# EAGLE schematic sang (EAGLE 6.0)
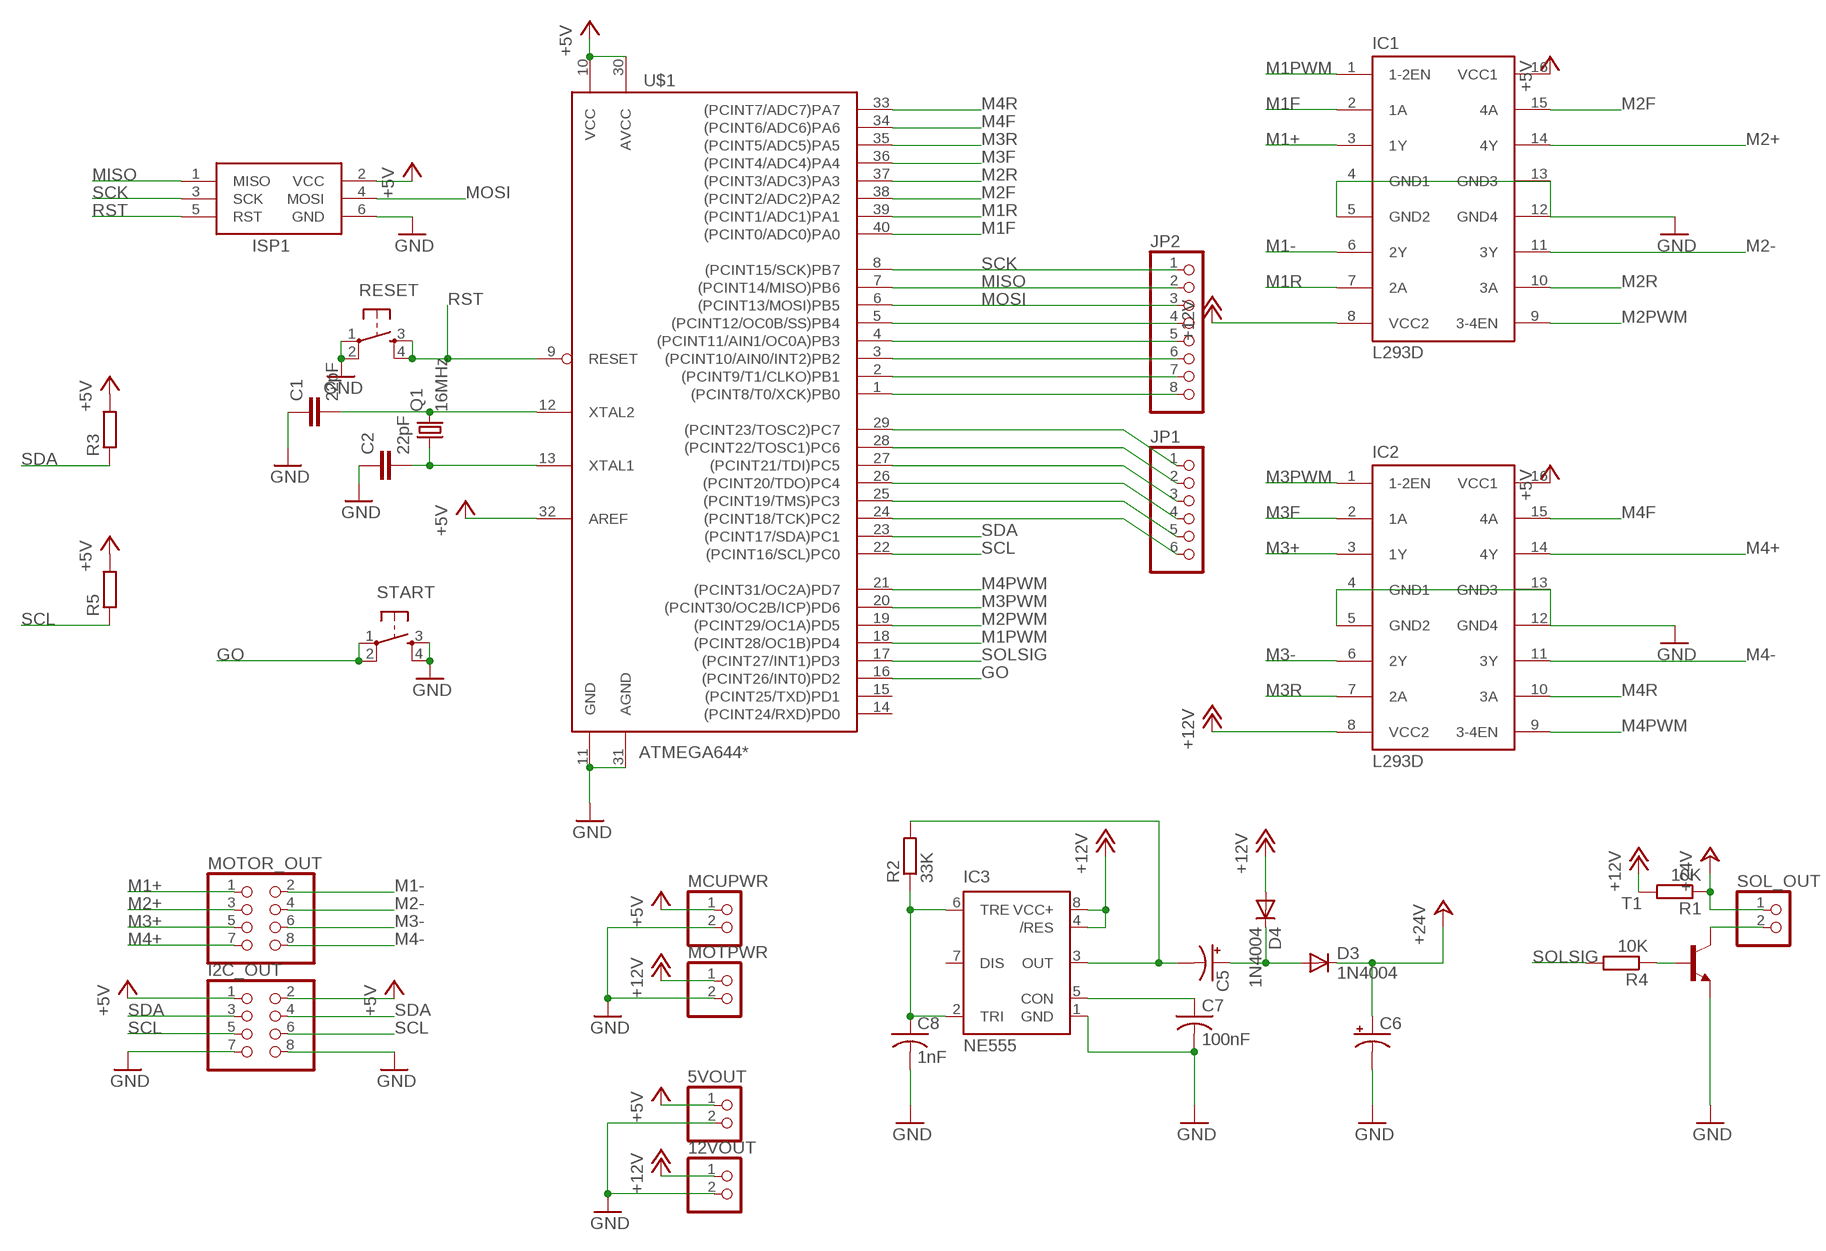
[diagram p0: schematic, sheet 1]

## Parts
5VOUT  PINHD-1X2  [1X02]
12VOUT  PINHD-1X2  [1X02]
C1  22pF  C2.5/2  [C2.5-2]
C2  22pF  C2.5/2  [C2.5-2]
C5  CPOL-USE7.5-18  [E7,5-18]
C6  CPOL-USE7.5-18  [E7,5-18]
C7  100nF  C-US025-030X050  [C025-030X050]
C8  1nF  C-US025-030X050  [C025-030X050]
D3  1N4004  [DO41-10]
D4  1N4004  [DO41-10]
I2C_OUT  PINHD-2X4  [2X04]
IC1  L293D  [DIL16]
IC2  L293D  [DIL16]
IC3  NE555  [DIL-08]
ISP1  AVRISP-6  [AVRISP]
JP1  PINHD-1X6  [1X06]
JP2  PINHD-1X8BIG  [1X08-BIG]
MCUPWR  PINHD-1X2  [1X02]
MOTOR_OUT  PINHD-2X4  [2X04]
MOTPWR  PINHD-1X2  [1X02]
Q1  16MHz  CRYSTALHC49U70  [HC49U70]
R1  10K  R-EU_0207/10  [0207/10]
R2  33K  R-EU_0207/10  [0207/10]
R3  R-EU_0204/7  [0204/7]
R4  10K  R-EU_0207/10  [0207/10]
R5  R-EU_0204/7  [0204/7]
RESET  TAC_SWITCHPTH  [TACTILE-PTH]
SOL_OUT  PINHD-1X2  [1X02]
START  TAC_SWITCHPTH  [TACTILE-PTH]
T1  2N2218-NPN-TO39-EBC  [TO39]
U$1  ATMEGA644*  [ATMEGA644]

## Nets
+5V [LowPow]: 5VOUT.1 I2C_OUT.1 I2C_OUT.2 IC1.16(VCC1) IC2.16(VCC1) ISP1.2(VCC) MCUPWR.1 R3.2 R5.2 U$1.10(VCC) U$1.30(AVCC) U$1.32(AREF)
+12V [HighPow]: 12VOUT.1 D4.A IC1.8(VCC2) IC2.8(VCC2) IC3.4(/RES) IC3.8(VCC+) MOTPWR.1 R1.2
+24V [HighPow]: C6.+ D3.C R1.1 SOL_OUT.1
GND [HighPow]: 5VOUT.2 12VOUT.2 C1.1 C2.1 C6.- C7.2 C8.2 I2C_OUT.7 I2C_OUT.8 IC1.4(GND1) IC1.5(GND2) IC1.12(GND4) IC1.13(GND3) IC2.4(GND1) IC2.5(GND2) IC2.12(GND4) IC2.13(GND3) IC3.1(GND) ISP1.6(GND) MCUPWR.2 MOTPWR.2 RESET.1 RESET.2 START.3 START.4 T1.1(E) U$1.11(GND) U$1.31(AGND)
GO: START.1 START.2 U$1.16((PCINT26/INT0)PD2)
M1+ [HighPow]: IC1.3(1Y) MOTOR_OUT.1
M1- [HighPow]: IC1.6(2Y) MOTOR_OUT.2
M1F: IC1.2(1A) U$1.40((PCINT0/ADC0)PA0)
M1PWM: IC1.1(1-2EN) U$1.18((PCINT28/OC1B)PD4)
M1R: IC1.7(2A) U$1.39((PCINT1/ADC1)PA1)
M2+: IC1.14(4Y) MOTOR_OUT.3
M2- [HighPow]: IC1.11(3Y) MOTOR_OUT.4
M2F: IC1.15(4A) U$1.38((PCINT2/ADC2)PA2)
M2PWM: IC1.9(3-4EN) U$1.19((PCINT29/OC1A)PD5)
M2R: IC1.10(3A) U$1.37((PCINT3/ADC3)PA3)
M3+ [HighPow]: IC2.3(1Y) MOTOR_OUT.5
M3- [HighPow]: IC2.6(2Y) MOTOR_OUT.6
M3F: IC2.2(1A) U$1.36((PCINT4/ADC4)PA4)
M3PWM: IC2.1(1-2EN) U$1.20((PCINT30/OC2B/ICP)PD6)
M3R: IC2.7(2A) U$1.35((PCINT5/ADC5)PA5)
M4+ [HighPow]: IC2.14(4Y) MOTOR_OUT.7
M4- [HighPow]: IC2.11(3Y) MOTOR_OUT.8
M4F: IC2.15(4A) U$1.34((PCINT6/ADC6)PA6)
M4PWM: IC2.9(3-4EN) U$1.21((PCINT31/OC2A)PD7)
M4R: IC2.10(3A) U$1.33((PCINT7/ADC7)PA7)
MISO [LowPow]: ISP1.1(MISO) JP2.2 U$1.7((PCINT14/MISO)PB6)
MOSI [LowPow]: ISP1.4(MOSI) JP2.3 U$1.6((PCINT13/MOSI)PB5)
N$1: C1.2 Q1.2 U$1.12(XTAL2)
N$2: C2.2 Q1.1 U$1.13(XTAL1)
N$3: C8.1 IC3.2(TRI) IC3.6(TRE) R2.1
N$4: R4.1 T1.2(B)
N$5: C5.- IC3.3(OUT) R2.2
N$6 [HighPow]: C5.+ D3.A D4.C
N$7: SOL_OUT.2 T1.3(C)
N$8: JP1.6 U$1.24((PCINT18/TCK)PC2)
N$9: C7.1 IC3.5(CON)
N$10: JP1.5 U$1.25((PCINT19/TMS)PC3)
N$11: JP1.4 U$1.26((PCINT20/TDO)PC4)
N$12: JP1.3 U$1.27((PCINT21/TDI)PC5)
N$13: JP1.2 U$1.28((PCINT22/TOSC1)PC6)
N$14: JP1.1 U$1.29((PCINT23/TOSC2)PC7)
N$15: JP2.8 U$1.1((PCINT8/T0/XCK)PB0)
N$16: JP2.7 U$1.2((PCINT9/T1/CLKO)PB1)
N$17: JP2.6 U$1.3((PCINT10/AIN0/INT2)PB2)
N$18: JP2.5 U$1.4((PCINT11/AIN1/OC0A)PB3)
N$19: JP2.4 U$1.5((PCINT12/OC0B/SS)PB4)
RST [LowPow]: ISP1.5(RST) RESET.3 RESET.4 U$1.9(RESET)
SCK [LowPow]: ISP1.3(SCK) JP2.1 U$1.8((PCINT15/SCK)PB7)
SCL: I2C_OUT.5 I2C_OUT.6 R5.1 U$1.22((PCINT16/SCL)PC0)
SDA: I2C_OUT.3 I2C_OUT.4 R3.1 U$1.23((PCINT17/SDA)PC1)
SOLSIG: R4.2 U$1.17((PCINT27/INT1)PD3)
Unconnected: IC3.7(DIS) U$1.14((PCINT24/RXD)PD0) U$1.15((PCINT25/TXD)PD1)

## Library data of the parts
5VOUT 12VOUT MCUPWR MOTPWR SOL_OUT = pinhead:PINHD-1X2: PIN HEADER
C1 C2 = capacitor-wima:C: CAPACITOR naming: grid - package width
C5 C6 = adafruit:CPOL-US: POLARIZED CAPACITOR, American symbol
C7 C8 = adafruit:C-US: CAPACITOR, American symbol
D3 D4 = adafruit:1N4004: DIODE General purpose 1N400x type rectifier (With bigger pads) http://www.ladyada.net/library/pcb/eaglelibrary.html
I2C_OUT MOTOR_OUT = pinhead:PINHD-2X4: PIN HEADER
IC1 IC2 = st-microelectronics:L293D: PUSH-PULL 4 CHANNEL DRIVER; MPN: L293D; OC_FARNELL: 9589619; OC_NEWARK: 56P8249
IC3 = st-microelectronics:NE555: General purpose bipolar Timer; MF: Arrow Electronics; MPN: NE555N; OC_FARNELL: 1467742; OC_NEWARK: 89K1486
ISP1 = adafruit:AVRISP: AVR ISP HEADER Standard 6 pin header for AVR programming
JP1 = adafruit:PINHD-1X6: PIN HEADER
JP2 = adafruit:PINHD-1X8: PIN HEADER
Q1 = crystal:CRYSTAL: CRYSTAL; OC_FARNELL: unknown; OC_NEWARK: unknown
R1 R3-R5 = resistor:R-EU_: RESISTOR, European symbol
R2 = rcl:R-EU_: RESISTOR, European symbol
RESET START = SparkFun:TAC_SWITCH: Momentary Switch Button commonly used for reset or general input. Spark Fun Electronics SKU : COM-00097
T1 = transistor:*-NPN-: NPN Transistror BF959 corrected 2008.03.06
U$1 = ATMega644:ATMEGA644

## Net classes
0 default: width 0.254 mm, drill 0.254 mm
1 HighPow: width 1.27 mm, drill 1.27 mm
2 LowPow: width 0.254 mm, drill 0.254 mm